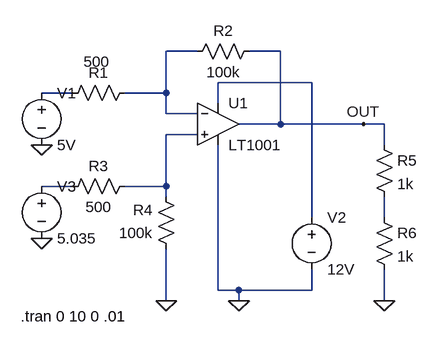
[diagram p0: schematic current2.asc]
current2.asc, the LTspice schematic file:
Version 4
SHEET 1 964 680
WIRE 352 48 304 48
WIRE 480 48 432 48
WIRE 528 96 384 96
WIRE 160 112 112 112
WIRE 304 112 304 48
WIRE 304 112 240 112
WIRE 384 128 384 96
WIRE 304 144 304 112
WIRE 352 144 304 144
WIRE 480 160 480 48
WIRE 480 160 416 160
WIRE 608 160 480 160
WIRE 640 160 608 160
WIRE 352 176 304 176
WIRE 640 192 640 160
WIRE 160 256 112 256
WIRE 304 256 304 176
WIRE 304 256 240 256
WIRE 304 272 304 256
WIRE 528 304 528 96
WIRE 640 304 640 272
WIRE 384 416 384 192
WIRE 416 416 384 416
WIRE 528 416 528 384
WIRE 528 416 416 416
WIRE 304 432 304 352
WIRE 416 432 416 416
WIRE 640 432 640 384
FLAG 416 432 0
FLAG 608 160 OUT
FLAG 304 432 0
FLAG 640 432 0
FLAG 112 192 0
FLAG 112 336 0
SYMBOL voltage 528 288 R0
WINDOW 123 0 0 Left 2
WINDOW 39 0 0 Left 2
SYMATTR InstName V2
SYMATTR Value 12V
SYMBOL Opamps\\LT1001 384 96 R0
SYMATTR InstName U1
SYMBOL res 256 96 R90
WINDOW 0 0 56 VBottom 2
WINDOW 3 -48 59 VTop 2
SYMATTR InstName R1
SYMATTR Value 500
SYMBOL res 448 32 R90
WINDOW 0 0 56 VBottom 2
WINDOW 3 32 56 VTop 2
SYMATTR InstName R2
SYMATTR Value 100k
SYMBOL res 256 240 R90
WINDOW 0 0 56 VBottom 2
WINDOW 3 32 56 VTop 2
SYMATTR InstName R3
SYMATTR Value 500
SYMBOL res 320 368 R180
WINDOW 0 36 76 Left 2
WINDOW 3 36 40 Left 2
SYMATTR InstName R4
SYMATTR Value 100k
SYMBOL res 624 176 R0
SYMATTR InstName R5
SYMATTR Value 1k
SYMBOL res 624 288 R0
SYMATTR InstName R6
SYMATTR Value 1k
SYMBOL voltage 112 96 R0
WINDOW 123 0 0 Left 2
WINDOW 39 0 0 Left 2
SYMATTR InstName V1
SYMATTR Value 5V
SYMBOL voltage 112 240 R0
WINDOW 123 0 0 Left 2
WINDOW 39 0 0 Left 2
SYMATTR InstName V3
SYMATTR Value 5.035
TEXT 80 456 Left 2 !.tran 0 10 0 .01

The netlist it stands for:
* current2.asc
V2 N002 0 12V
XU1 N004 N001 N002 0 OUT LT1001  ; pins In+ In- V+ V- OUT
R1 N001 N003 500
R2 OUT N001 100k
R3 N004 N005 500
R4 0 N004 100k
R5 OUT N006 1k
R6 N006 0 1k
V1 N003 0 5V
V3 N005 0 5.035
.tran 0 10 0 .01
.lib LTC.lib
.backanno
.end